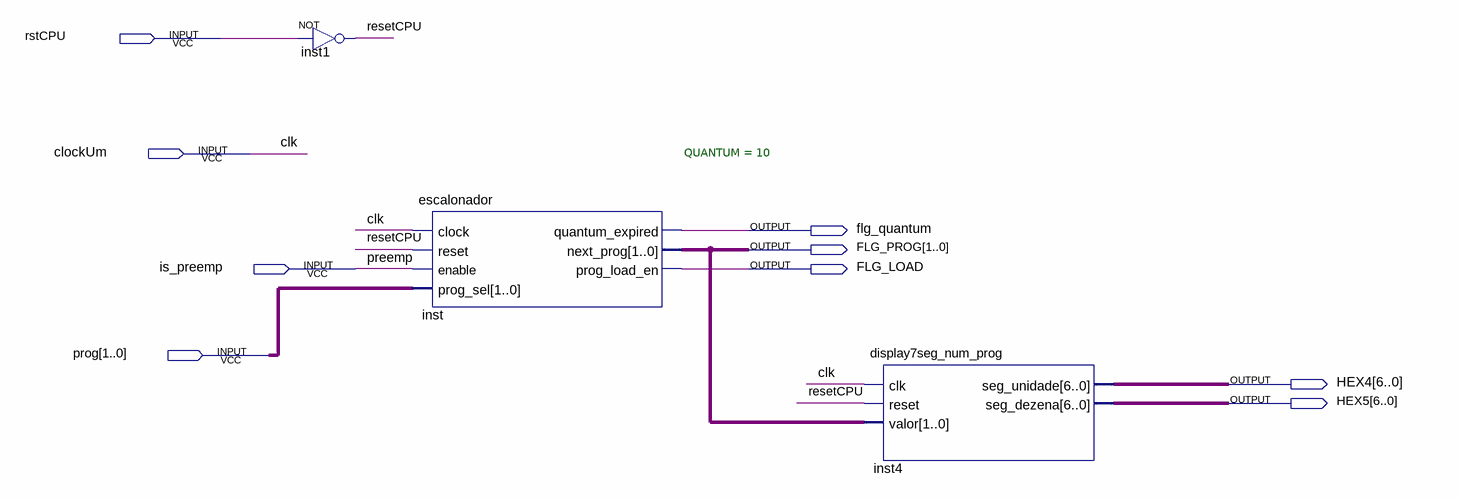
[diagram p0: schematic sheet]
// Quartus schematic testeEscalonador_E_DisplaySegmentos.bdf as structural Verilog: 3 symbols, 9 pins
module testeEscalonador_E_DisplaySegmentos (
  input  rstCPU,
  input  clockUm,
  input  is_preemp,
  input  [1:0] prog,
  output flg_quantum,
  output [1:0] FLG_PROG,
  output FLG_LOAD,
  output [6:0] HEX4,
  output [6:0] HEX5
);

  wire resetCPU;

  not inst1 (resetCPU, rstCPU);
  escalonador #(.QUANTUM(10)) inst (
    .clock(clockUm), .reset(resetCPU), .enable(is_preemp), .prog_sel(prog), .quantum_expired(flg_quantum),
    .next_prog(FLG_PROG), .prog_load_en(FLG_LOAD));
  display7seg_num_prog inst4 (.clk(clockUm), .reset(resetCPU), .valor(FLG_PROG), .seg_unidade(HEX4), .seg_dezena(HEX5));

  // Other names for the same wires on the sheet: clk = clockUm; preemp = is_preemp
endmodule
